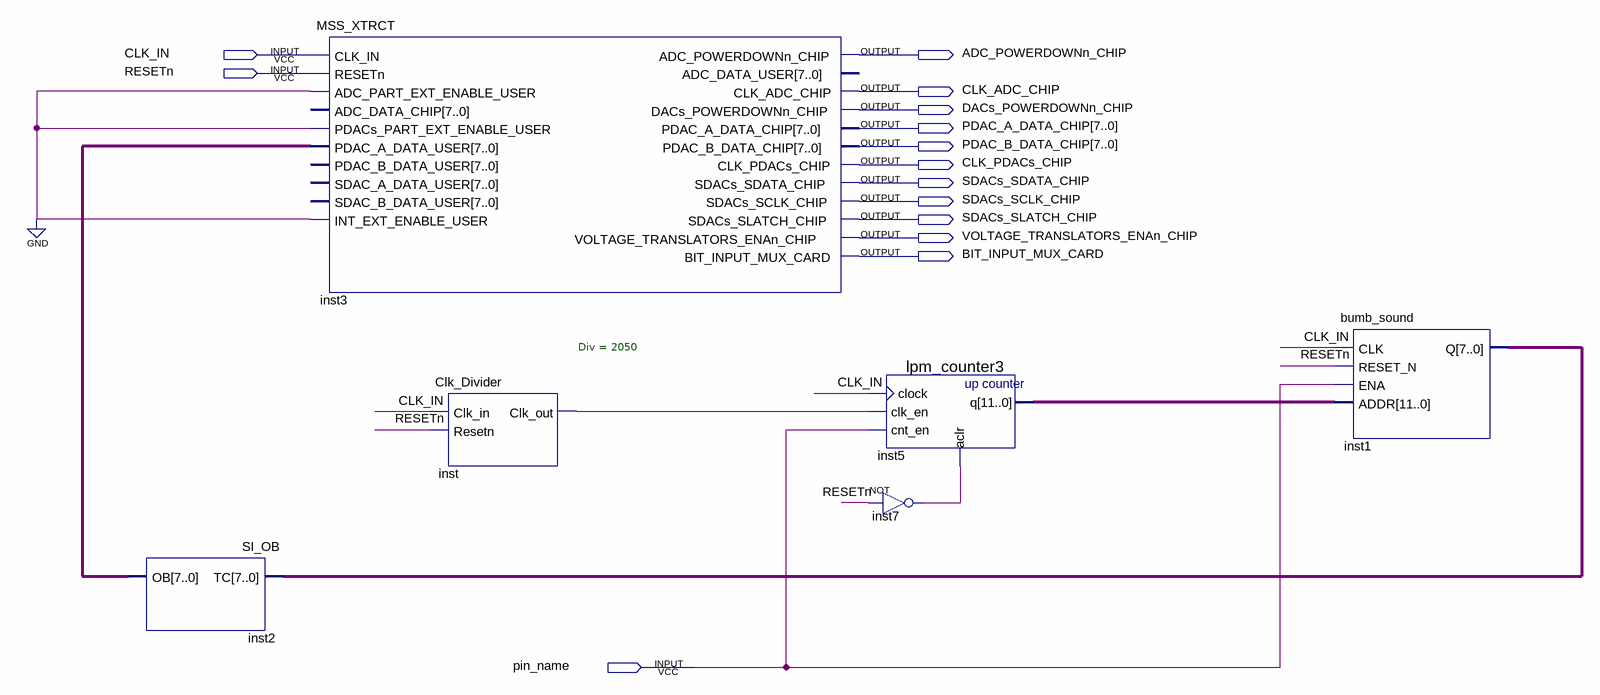
[diagram p0: schematic sheet]
// Quartus schematic bumb_sound_box.bdf as structural Verilog: 6 symbols, 14 pins
module bumb_sound_box (
  input  CLK_IN,
  input  RESETn,
  input  pin_name,
  output ADC_POWERDOWNn_CHIP,
  output CLK_ADC_CHIP,
  output DACs_POWERDOWNn_CHIP,
  output [7:0] PDAC_A_DATA_CHIP,
  output [7:0] PDAC_B_DATA_CHIP,
  output CLK_PDACs_CHIP,
  output SDACs_SDATA_CHIP,
  output SDACs_SCLK_CHIP,
  output SDACs_SLATCH_CHIP,
  output VOLTAGE_TRANSLATORS_ENAn_CHIP,
  output BIT_INPUT_MUX_CARD
);

  wire inst7_out, inst_clk_out;
  wire [7:0] inst1_q, inst2_ob;
  wire [11:0] inst5_q;

  SI_OB inst2 (.TC(inst1_q), .OB(inst2_ob));
  MSS_XTRCT inst3 (
    .CLK_IN(CLK_IN), .RESETn(RESETn), .ADC_PART_EXT_ENABLE_USER(1'b0), .PDACs_PART_EXT_ENABLE_USER(1'b0),
    .PDAC_A_DATA_USER(inst2_ob), .INT_EXT_ENABLE_USER(1'b0), .ADC_POWERDOWNn_CHIP(ADC_POWERDOWNn_CHIP),
    .CLK_ADC_CHIP(CLK_ADC_CHIP), .DACs_POWERDOWNn_CHIP(DACs_POWERDOWNn_CHIP),
    .PDAC_A_DATA_CHIP(PDAC_A_DATA_CHIP), .PDAC_B_DATA_CHIP(PDAC_B_DATA_CHIP),
    .CLK_PDACs_CHIP(CLK_PDACs_CHIP), .SDACs_SDATA_CHIP(SDACs_SDATA_CHIP), .SDACs_SCLK_CHIP(SDACs_SCLK_CHIP),
    .SDACs_SLATCH_CHIP(SDACs_SLATCH_CHIP), .VOLTAGE_TRANSLATORS_ENAn_CHIP(VOLTAGE_TRANSLATORS_ENAn_CHIP),
    .BIT_INPUT_MUX_CARD(BIT_INPUT_MUX_CARD));  // open: ADC_DATA_CHIP, PDAC_B_DATA_USER, SDAC_A_DATA_USER, SDAC_B_DATA_USER, ADC_DATA_USER
  Clk_Divider #(.Div(2050)) inst (.Clk_in(CLK_IN), .Resetn(RESETn), .Clk_out(inst_clk_out));
  lpm_counter3 inst5 (.clock(CLK_IN), .clk_en(inst_clk_out), .cnt_en(pin_name), .aclr(inst7_out), .q(inst5_q));
  not inst7 (inst7_out, RESETn);
  bumb_sound inst1 (.CLK(CLK_IN), .RESET_N(RESETn), .ENA(pin_name), .ADDR(inst5_q), .Q(inst1_q));
endmodule
